# Altium schematic sheet MCU.SchDoc
size 431 x 279 mm; SheetNumber: 1; SheetTotal: 4
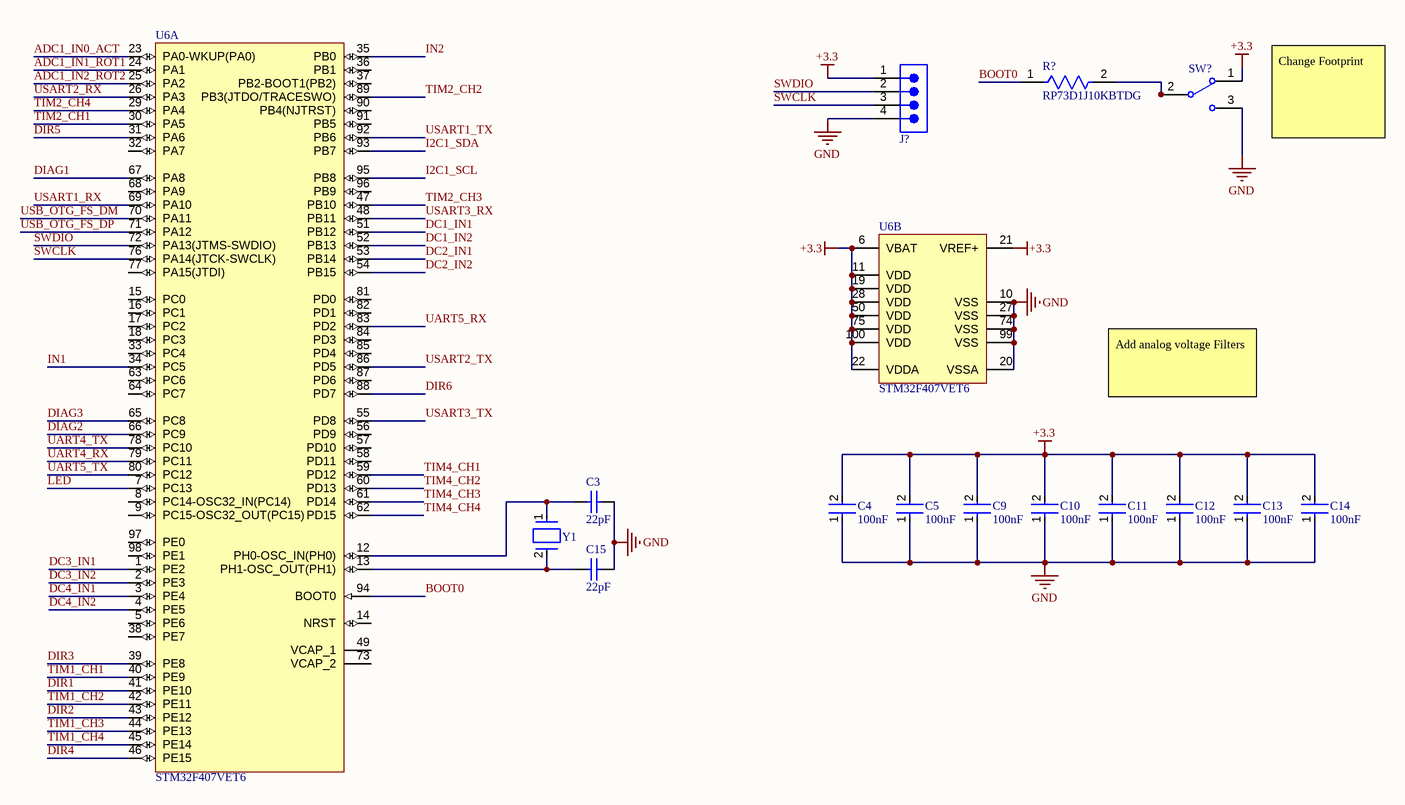
[diagram p0: MCU.SchDoc]

## Parts
C3  Capacitance: 22pF  [CAPC1608X90X35ML10T15]  (hidden comment: GRM1885C1H220JA01D)
C4  Capacitance: 100nF  [FP-CGA3E-0_3-0_1-IPC_A]  (hidden comment: CGA3E2X7R1H104K080AA)
C5  Capacitance: 100nF  [FP-CGA3E-0_3-0_1-IPC_A]  (hidden comment: CGA3E2X7R1H104K080AA)
C9  Capacitance: 100nF  [FP-CGA3E-0_3-0_1-IPC_A]  (hidden comment: CGA3E2X7R1H104K080AA)
C10  Capacitance: 100nF  [FP-CGA3E-0_3-0_1-IPC_A]  (hidden comment: CGA3E2X7R1H104K080AA)
C11  Capacitance: 100nF  [FP-CGA3E-0_3-0_1-IPC_A]  (hidden comment: CGA3E2X7R1H104K080AA)
C12  Capacitance: 100nF  [FP-CGA3E-0_3-0_1-IPC_A]  (hidden comment: CGA3E2X7R1H104K080AA)
C13  Capacitance: 100nF  [FP-CGA3E-0_3-0_1-IPC_A]  (hidden comment: CGA3E2X7R1H104K080AA)
C14  Capacitance: 100nF  [FP-CGA3E-0_3-0_1-IPC_A]  (hidden comment: CGA3E2X7R1H104K080AA)
C15  Capacitance: 22pF  [CAPC1608X90X35ML10T15]  (hidden comment: GRM1885C1H220JA01D)
J?  61300411121  [61300411121]  (value not drawn)
R?  RP73D1J10KBTDG  [FP-RP731J-MFG]
SW?  EG1218  [ESWI-EG1218_V]  (value not drawn)
U6  STM32F407VET6  [STM-LQFP100_M]  (parts A,B of 2)
Y1  ABLS-8.000MHZ-B2-T  [FP-ABLS-MFG]  (value not drawn)

## Nets
+3.3: C4.2 C5.2 C9.2 C10.2 C11.2 C12.2 C13.2 C14.2 J?.1 SW?.1 U6.6(VBAT) U6.11(VDD) U6.19(VDD) U6.21(VREF+) U6.22(VDDA) U6.28(VDD) U6.50(VDD) U6.75(VDD) U6.100(VDD)
GND: C3.1 C4.1 C5.1 C9.1 C10.1 C11.1 C12.1 C13.1 C14.1 C15.1 J?.4 SW?.3 U6.10(VSS) U6.20(VSSA) U6.27(VSS) U6.74(VSS) U6.99(VSS)
ADC1_IN0_ACT: U6.23(PA0-WKUP(PA0))
ADC1_IN1_ROT1: U6.24(PA1)
ADC1_IN2_ROT2: U6.25(PA2)
BOOT0: R?.1 U6.94(BOOT0)
DC1_IN1: U6.51(PB12)
DC1_IN2: U6.52(PB13)
DC2_IN1: U6.53(PB14)
DC2_IN2: U6.54(PB15)
DC3_IN1: U6.1(PE2)
DC3_IN2: U6.2(PE3)
DC4_IN1: U6.3(PE4)
DC4_IN2: U6.4(PE5)
DIAG1: U6.67(PA8)
DIAG2: U6.66(PC9)
DIAG3: U6.65(PC8)
DIR1: U6.41(PE10)
DIR2: U6.43(PE12)
DIR3: U6.39(PE8)
DIR4: U6.46(PE15)
DIR5: U6.31(PA6)
DIR6: U6.88(PD7)
I2C1_SCL: U6.95(PB8)
I2C1_SDA: U6.93(PB7)
IN1: U6.34(PC5)
IN2: U6.35(PB0)
LED: U6.7(PC13)
SWCLK: J?.3 U6.76(PA14(JTCK-SWCLK))
SWDIO: J?.2 U6.72(PA13(JTMS-SWDIO))
TIM1_CH1: U6.40(PE9)
TIM1_CH2: U6.42(PE11)
TIM1_CH3: U6.44(PE13)
TIM1_CH4: U6.45(PE14)
TIM2_CH1: U6.30(PA5)
TIM2_CH2: U6.89(PB3(JTDO/TRACESWO))
TIM2_CH3: U6.47(PB10)
TIM2_CH4: U6.29(PA4)
TIM4_CH1: U6.59(PD12)
TIM4_CH2: U6.60(PD13)
TIM4_CH3: U6.61(PD14)
TIM4_CH4: U6.62(PD15)
UART4_RX: U6.79(PC11)
UART4_TX: U6.78(PC10)
UART5_RX: U6.83(PD2)
UART5_TX: U6.80(PC12)
USART1_RX: U6.69(PA10)
USART1_TX: U6.92(PB6)
USART2_RX: U6.26(PA3)
USART2_TX: U6.86(PD5)
USART3_RX: U6.48(PB11)
USART3_TX: U6.55(PD8)
USB_OTG_FS_DM: U6.70(PA11)
USB_OTG_FS_DP: U6.71(PA12)
NetC3_2: C3.2 U6.12(PH0-OSC_IN(PH0)) Y1.1
NetC15_2: C15.2 U6.13(PH1-OSC_OUT(PH1)) Y1.2
NetR?_2: R?.2 SW?.2(COM)

Not connected (* = marked no-connect by the designer): U6 5(PE6) 8(PC14-OSC32_IN(PC14)) 9(PC15-OSC32_OUT(PC15)) 14(NRST) 15(PC0) 16(PC1) 17(PC2) 18(PC3) 32(PA7) 33(PC4) 36(PB1) 37(PB2-BOOT1(PB2)) 38(PE7) 49(VCAP_1) 56(PD9) 57(PD10) 58(PD11) 63(PC6) 64(PC7) 68(PA9) 73(VCAP_2) 77(PA15(JTDI)) 81(PD0) 82(PD1) 84(PD3) 85(PD4) 87(PD6) 90(PB4(NJTRST)) 91(PB5) 96(PB9) 97(PE0) 98(PE1)

## Notes on the sheet
- Change Footprint
- Add analog voltage Filters
- DWG. NO.
- REV.
- SHT.
- THIS DOCUMENT AND THE DATA DISCLOSED HEREIN OR HEREWITH IS THE PROPERTY OF ALTIUM LIMITED AND MAY BE FREELY DISTRIBUTED IN WHOLE. NO RIGHTS ARE RESERVED OR EXPRESS OR IMPLIED WARANTEE GIVEN.
- REVISION
- DESCRIPTION
- DATE
- APPROVED
- ENG:
- APPROVALS
- PROJECT
- DSN:
- CHK:
- REFERENCE DOCUMENTS
- PROJECT REVISION:
- TITLE
- DOCUMENT REVISION:
- DESIGN ITEM:
- BOM:
- FAB DWG:
- PCB DWG:
- ASSY DWG:
- SCALE:
- SIZE
- B
- CAGE CODE
- FILE NAME
- DWG NO.
- SHEET
- OF
- REV

## Library data of the parts
C3 C15 = CMP-2000-04945-1: Chip Capacitor, 22 pF, +/- 5%, 50 V, -55 to 125 degC, 0603 (1608 Metric), RoHS, Tape and Reel; Manufacturer: Murata; Rated Voltage: 50V; Dielectric: C0G; Manufacturer URL: http://www.murata.com/; Datasheet Version: Jul-06; Package Reference: 603; Tolerance (%): ±5%; Case Size/Dimension: 0603; Package Description: 2-Pin Surface Mount Device, Body 1.6 x 0.8 mm; Datasheet URL: https://datasheet.ciiva.com/11786/0900766b807a1cab-11786398.pdf
C4 C5 C9-C14 = CMP-2000-07546-2: Cap Ceramic 100nF 50V X7R 10% Pad SMD 0603 +125°C Automotive T/R; Weight: 7.1E-05oz; Composition: Ceramic; Max Operating Temperature: 125°C; Termination: SMD/SMT; Dielectric: X7R; Length: 1.6mm; Package Quantity: 1; REACH SVHC: No SVHC; Lead Free: Lead Free; Case Code (Metric): 1608; Min Operating Temperature: -55°C; Packaging: Tape and Reel; Tolerance: 10%; Voltage Rating: 50V; Case Code (Imperial): 0603; Case/Package: 0603; Voltage Rating (DC): 50V; Depth: 0.8mm; Radiation Hardening: No; Ratings: AEC-Q200; Mount: Surface Mount; Voltage: 50V; Thickness: 0.035inch; Width: 0.8mm; Height: 0.8mm; LCSC: C14663
J? = CMP-1502-01064-3: NexarPartId: 32855522; Operating Supply Voltage: 250V; Pitch: 2.54mm; Contact Resistance: 20mΩ; Number of Positions: 4; Current Rating: 3A; Connector Type: Male Pin; Gender: Male; Contact Plating: Gold; Height: 8.89mm; Lead Pitch: 2.54mm; Lead Free: Lead Free; Contact Mating Length: 5.9944mm; Number of Rows: 1; Termination: Solder; Packaging: Bulk; REACH SVHC: Unknown; Min Operating Temperature: -40°C; RoHS: Compliant; Number of Contacts: 4; Voltage Rating: 250V; Color: Black; Max Operating Temperature: 105°C; Contact Material: Copper; Mount: Through Hole; Orientation: Vertical; Number of Pins: 4
R? = CMP-03211-006887-1: TE CONNECTIVITY / HOLSWORTHY SMD Chip Resistor, Thin Film, 10KΩ, 50 V, 0603 [1608 Metric], 100 mW, 0.1% , RP73 Series; Voltage Rating: 75V; Power Rating: 0.1W; Temperature Coefficient: 15ppm/°C; Lead Free: Yes; Tolerance: 0.1%; Category: Res; Ipc Land Pattern Name: RESC15580X45; Composition: Thin Film; octopart_url: https://octopart.com/rp73d1j10kbtdg-te+connectivity-42631518; ComponentLink2URL: https://www.te.com/commerce/DocumentDelivery/DDEController?Action=srchrtrv&DocNm=1773272&DocType=DS&DocLang=English; Device Class L1: Passive Components; packaging: cut tape; Device Class L3: Chip SMD Resistors; Temperature Range Low: -55°C; Package: RP731J; Value: 10KΩ; ComponentLink2Description: Datasheet; RoHS: TRUE; Temperature: -55°C to +105°C; Height: 0.55mm; Automotive: No; Resistance: 10KΩ; Series: RP73; Octopart: https://octopart.com/rp73d1j10kbtdg-te+connectivity-42631518; Manufacturer: TE Connectivity; Temperature Range High: +105°C; Manufacturer Part Number: RP73D1J10KBTDG; Device Class L2: Resistors
SW? = CMP-1696-00002-1: Slide Switch, 500 V, -20 to 70 degC, 3-Pin THD, RoHS; Case\Package: SOT-23-5; Output Current: 150 mA; Nominal Output Voltage: 3.3 V; Max Power Dissipation: 250 mW; Min Input Voltage: 4.3 V; Outputs: 1; Max Input Voltage: 8 V; Dropout Voltage: 300 mV; PackageDescription: 3-Pin Through Hole Device, Body 11.6 x 4 mm, Pitch 2.5 mm; ComponentLink1URL: http://www.e-switch.ch/en/; RoHSCompliant: true; Length: 3 mm; ComponentLink1Description: Manufacturer URL; Power Rating: 250 mW; Mount: Surface Mount; Max Operating Temperature: 85 degC; REACH SVHC: No SVHC; Radiation Hardening: No; Height: 1.3 mm; Pins: 5; Max Ouput Current: 150 mA; Output Voltage: 3.3 V; Width: 1.8 mm; Package Quantity: 3000; ComponentLink2URL: https://www.e-switch.com/system/asset/product_line/data_sheet/119/EG.pdf; Min Operating Temperature: -40 degC; ComponentLink2Description: Datasheet; DatasheetVersion: Oct-15; PackageReference: EG1218; Packaging: Tape and Reel
U6 = CMP-0243-00016-3: ARM Cortex-M4 32-bit MCU+FPU, 210 DMIPS, 512 kB Flash, 192 kB Internal RAM, 82 I/Os, 100-pin LQFP, -40 to 85 degC, Tray; Manufacturer: STMicroelectronics; Supply Voltage(Vcc) max (V): 3.6; Supply Voltage(Vcc) min (V): 1.8; I/Os (High Current): 82; FLASH Size (Prog) (kB): 512; Operating Frequency(F) (Processor speed) (MHz): 168; D/A Converter: 2x12-bit; Internal RAM Size (kB): 192; PackageReference: LQFP100; Core: ARM Cortex-M4; ComponentLink1URL: http://www.st.com/web/en/home.html; ComponentLink1Description: Manufacturer URL; DatasheetVersion: Rev. 4; Packing: Tray; Mounting Technology: Surface Mount; ComponentLink2Description: Datasheet; ComponentLink2URL: http://www.st.com/st-web-ui/static/active/en/resource/technical/document/datasheet/DM00037051.pdf; ComponentLink3Description: Package Specification; PartNumber: STM32F407VET6; PackageVersion: Rev. 1, 06/2013; PackageDescription: 100-Pin Low Profile Quad Flat Package, 14 x 14 mm Body, 0.5 mm Pitch; ComponentLink3URL: http://www.st.com/st-web-ui/static/active/en/resource/technical/document/data_brief/DM00071938.pdf; LCSC: C28730
Y1 = CMP-27762-009874-1: CRYSTAL 8.0000MHZ 18PF SMD; ESR (Equivalent Series Resistance): 80R; Operating Frequency: 8 MHz; Frequency Stability: 50ppm; Tolerance: 20ppm; Frequency: 8MHz; Min Operating Temperature: -20°C; Lead Free: Lead Free; Width: 4.7mm; Packaging: Tape and Reel; Series: ABLS; Accuracy: 20ppm; Length: 11.4mm; Frequency Tolerance: 20ppm; Termination: SMD/SMT; Number of Pins: 2; Radiation Hardening: No; Depth: 4.7mm; REACH SVHC: No SVHC; Contact Plating: Tin; Load Capacitance: 18pF; Case/Package: SMD/SMT; Mount: Surface Mount; Package Quantity: 1000; Max Operating Temperature: 70°C; Height: 0.165inch; Series Resistance: 80R